# EAGLE design CrawlerProc_ver_02 (EAGLE 6.5.0)
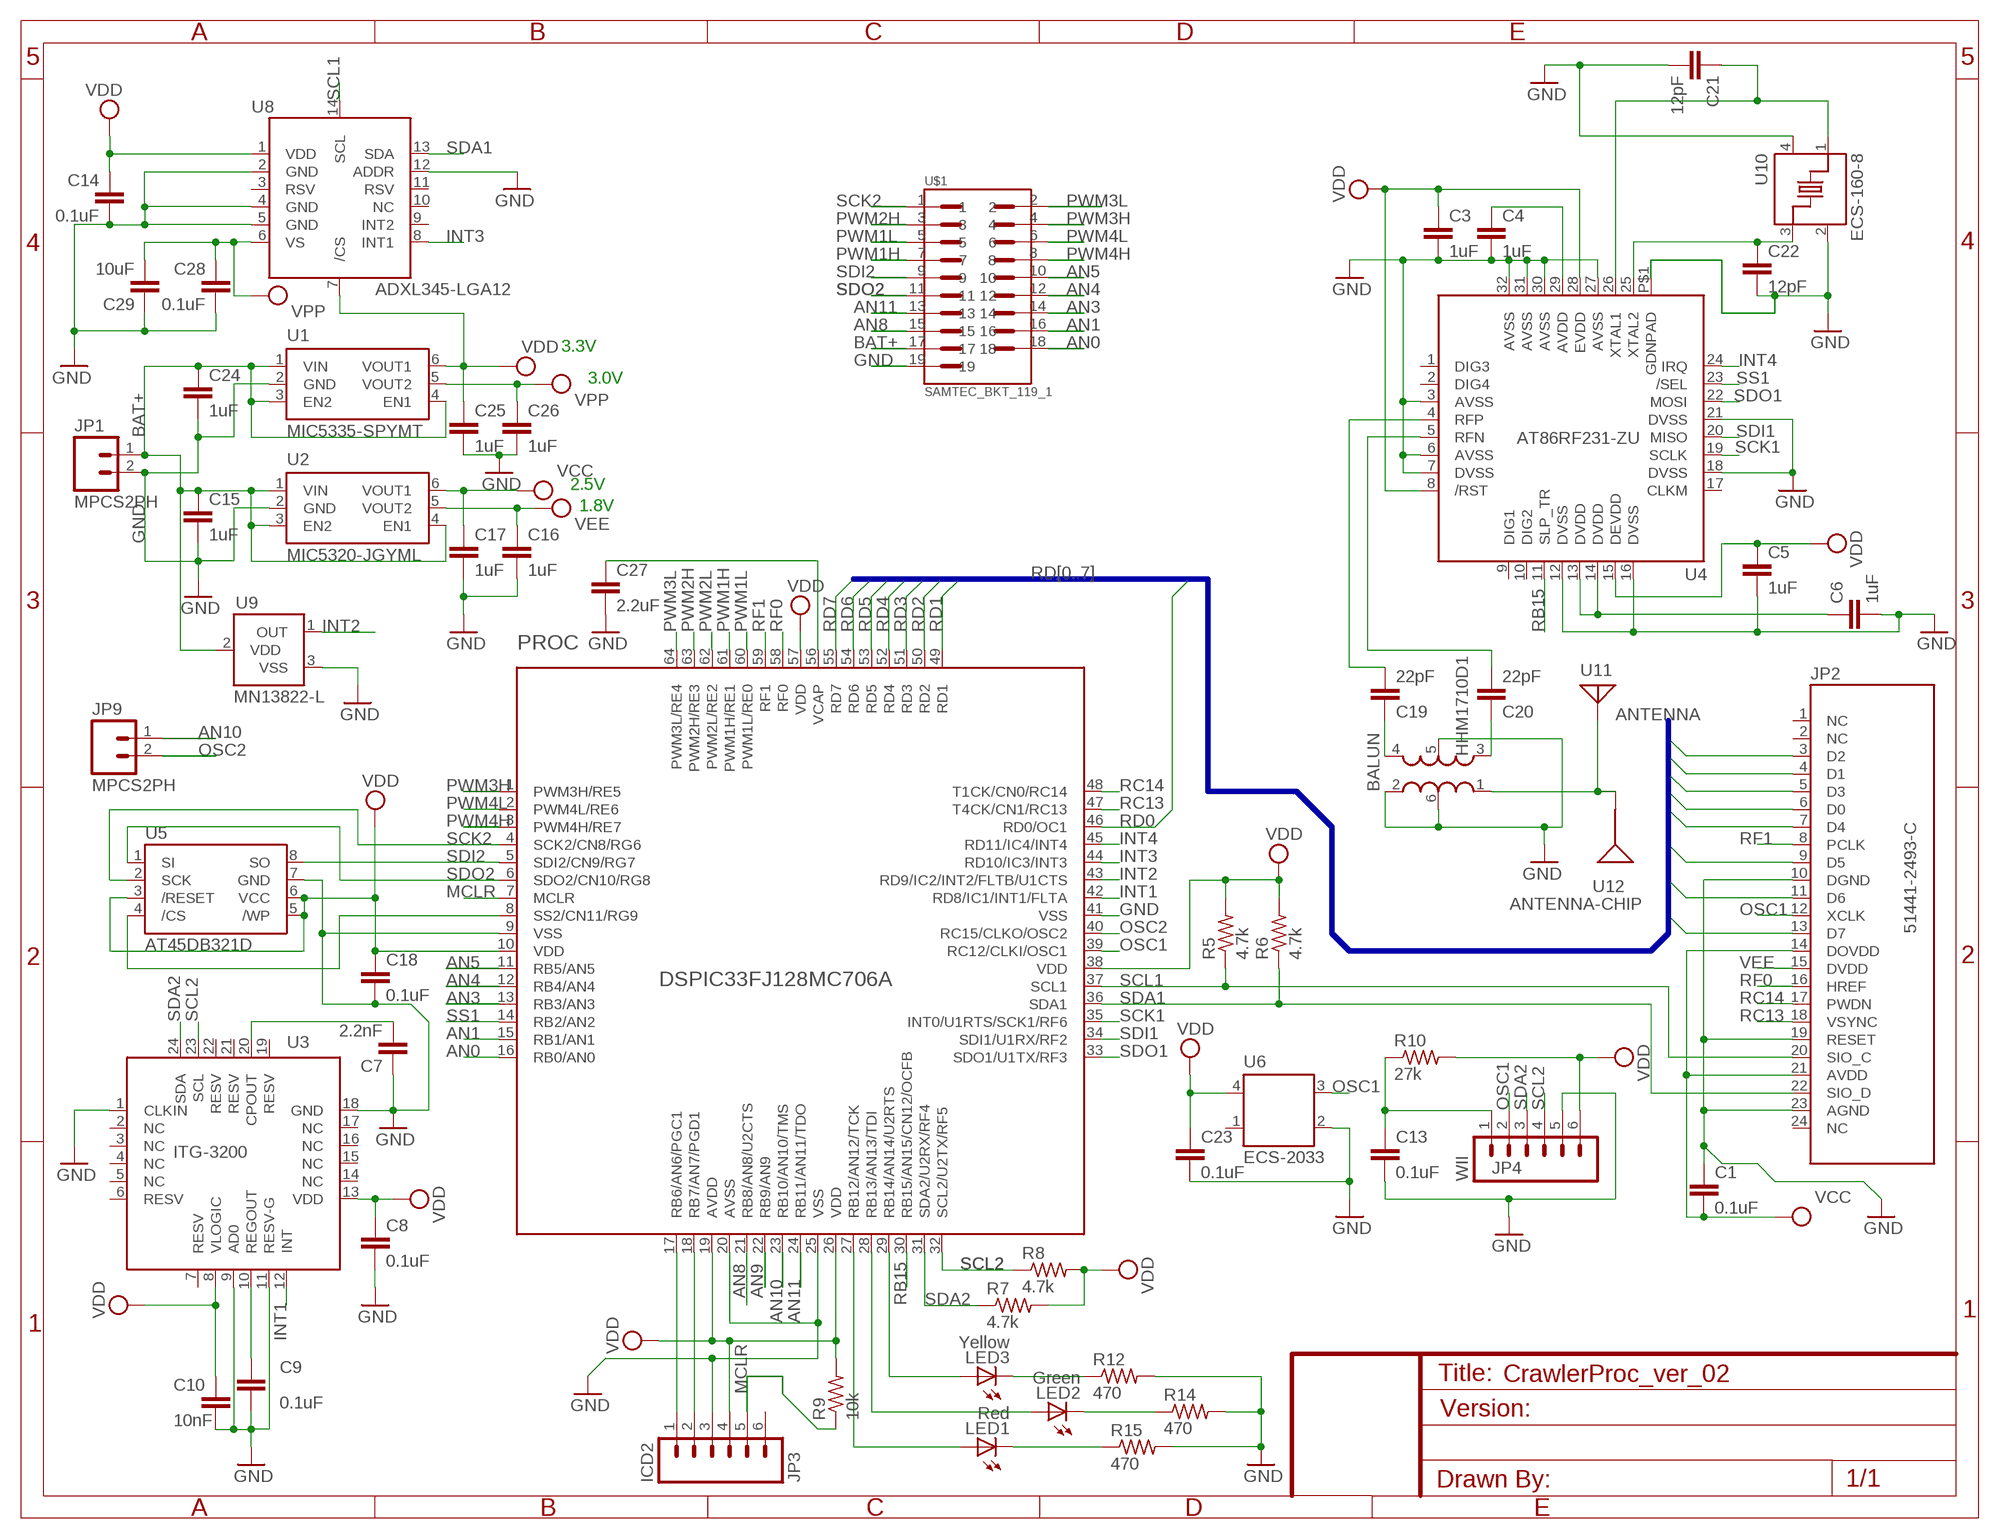
[diagram p0: schematic, sheet 1]

## Parts
BALUN  HHM1710D1  BALUNA  [BALUN]
C1  0.1uF  CAP0402-CAP  [0402-CAP]
C3  1uF  CAP0402-CAP  [0402-CAP]
C4  1uF  CAP0402-CAP  [0402-CAP]
C5  1uF  CAP0402-CAP  [0402-CAP]
C6  1uF  CAP0402-CAP  [0402-CAP]
C7  2.2nF  CAP0402-CAP  [0402-CAP]
C8  0.1uF  CAP0402-CAP  [0402-CAP]
C9  0.1uF  CAP0402-CAP  [0402-CAP]
C10  10nF  CAP0402-CAP  [0402-CAP]
C13  0.1uF  CAP0402-CAP  [0402-CAP]
C14  0.1uF  CAP0402-CAP  [0402-CAP]
C15  1uF  CAP0402-CAP  [0402-CAP]
C16  1uF  CAP0402-CAP  [0402-CAP]
C17  1uF  CAP0402-CAP  [0402-CAP]
C18  0.1uF  CAP0402-CAP  [0402-CAP]
C19  22pF  CAP0402-CAP  [0402-CAP]
C20  22pF  CAP0402-CAP  [0402-CAP]
C21  12pF  CAP0402-CAP  [0402-CAP]
C22  12pF  CAP0402-CAP  [0402-CAP]
C23  0.1uF  CAP0402-CAP  [0402-CAP]
C24  1uF  CAP0402-CAP  [0402-CAP]
C25  1uF  CAP0402-CAP  [0402-CAP]
C26  1uF  CAP0402-CAP  [0402-CAP]
C27  2.2uF  CAP0402-CAP  [0402-CAP]
C28  0.1uF  CAP0402-CAP  [0402-CAP]
C29  10uF  CAP0603-CAP  [0603-CAP]
JP1  MPCS2PH  [MOLEX-PICO_CLASP_S2P]
JP2  51441-2493-C  OV7660FSL_CON-24  [MOLEX-52740-2490]
JP3  ICD2  MPCS6PH  [MOLEX-PICO_CLASP_S6P]
JP4  WII  MPCS6PH  [MOLEX-PICO_CLASP_S6P]
JP9  MPCS2PH  [MOLEX-PICO_CLASP_S2P]
LED1  Red  LEDCHIP-LED0603  [CHIP-LED0603]
LED2  Green  LEDCHIP-LED0603  [CHIP-LED0603]
LED3  Yellow  LEDCHIP-LED0603  [CHIP-LED0603]
PROC  DSPIC33FJ128MC706A  DSPIC33FJ128MC706-I/PT  [TQFP64]
R5  4.7k  R-US_R0402  [R0402]
R6  4.7k  R-US_R0402  [R0402]
R7  4.7k  R-US_R0402  [R0402]
R8  4.7k  R-US_R0402  [R0402]
R9  10k  R-US_R0402  [R0402]
R10  27k  R-US_R0402  [R0402]
R12  470  R-US_R0402  [R0402]
R14  470  R-US_R0402  [R0402]
R15  470  R-US_R0402  [R0402]
U1  MIC5335-SPYMT  MIC5320-JGYML  [MLF-6]
U2  MIC5320-JGYML  [MLF-6]
U3  ITG-3200  ITG-3200-00  [QFN-24]
U4  AT86RF231-ZU  [QFN-32]
U5  AT45DB321D  [MLF(VDFN)-8]
U6  ECS-2033  OSCILLATORS  [OSCILLATOR-SMD]
U8  ADXL345-LGA12  ADXL345  [LGA14]
U9  MN13822-L  VOL_DETECTOR  [SOT-23-3]
U10  ECS-160-8  CRYSTALS  [CRYSTAL-SMD]
U11  ANTENNA  [ANTENNA_PAD]
U12  ANTENNA-CHIP  [ANTENNA-CHIP]
U$1  SAMTEC_BKT_119_1  [SAMTEC_19P_1MM_MICRO_CONN]

## Nets
AN0: PROC.16(RB0/AN0) U$1.18
AN1: PROC.15(RB1/AN1) U$1.16
AN3: PROC.13(RB3/AN3) U$1.14
AN4: PROC.12(RB4/AN4) U$1.12
AN5: PROC.11(RB5/AN5) U$1.10
AN8: PROC.21(RB8/AN8/U2CTS) U$1.15
AN9: PROC.22(RB9/AN9)
AN10: JP9.1 PROC.23(RB10/AN10/TMS)
AN11: PROC.24(RB11/AN11/TDO) U$1.13
BAT+ [sup]: C15.1 C24.1 JP1.1 U1.1(VIN) U1.3(EN2) U1.4(EN1) U2.1(VIN) U2.3(EN2) U2.4(EN1) U9.2(VDD) U$1.17
GND [sup]: BALUN.2(RFGND) BALUN.5(GND) BALUN.6(NC) C1.1 C3.2 C4.2 C5.2 C6.2 C7.1 C8.2 C9.2 C10.2 C13.2 C14.2 C15.2 C16.2 C17.2 C18.2 C21.2 C22.2 C23.2 C24.2 C25.2 C26.2 C27.2 C28.2 C29.1 JP1.2 JP2.10(DGND) JP2.19(RESET) JP2.23(AGND) JP3.3 JP4.5 PROC.9(VSS) PROC.20(AVSS) PROC.25(VSS) PROC.41(VSS) R12.2 R14.2 R15.2 U1.2(GND) U2.2(GND) U3.1(CLKIN) U3.9(AD0) U3.11(RESV-G) U3.18(GND) U4.3(AVSS) U4.6(AVSS) U4.7(DVSS) U4.12(DVSS) U4.16(DVSS) U4.18(DVSS) U4.21(DVSS) U4.27(AVSS) U4.30(AVSS) U4.31(AVSS) U4.32(AVSS) U4.P$1(GDNPAD) U5.7(GND) U6.2(GND) U8.2(GND) U8.4(GND) U8.5(GND) U8.12(ADDR) U9.3(VSS) U10.2(GND) U10.4(GND) U$1.19
INT1: PROC.42(RD8/IC1/INT1/FLTA) U3.12(INT)
INT2: PROC.43(RD9/IC2/INT2/FLTB/U1CTS) U9.1(OUT)
INT3: PROC.44(RD10/IC3/INT3) U8.8(INT1)
INT4: PROC.45(RD11/IC4/INT4) U4.24(IRQ)
MCLR: JP3.5 PROC.7(MCLR) R9.1
N$1: C27.1 PROC.56(VCAP)
N$3: LED3.C R12.1
N$6: LED3.A PROC.29(RB14/AN14/U2RTS)
N$7: LED2.C R14.1
N$8: LED1.C R15.1
N$9: LED2.A PROC.28(RB13/AN13/TDI)
N$11: LED1.A PROC.27(RB12/AN12/TCK)
N$21: JP3.1 PROC.17(RB6/AN6/PGC1)
N$23: C4.1 U4.29(AVDD)
N$24: JP3.2 PROC.18(RB7/AN7/PGD1)
N$28: C6.1 U4.13(DVDD) U4.14(DVDD)
N$29: C7.2 U3.20(CPOUT)
N$32: C9.1 U3.10(REGOUT)
N$43: BALUN.4(BAL4) C19.1
N$46: BALUN.3(BAL3) C20.1
N$47: C19.2 U4.4(RFP)
N$48: PROC.8(SS2/CN11/RG9) U5.4(/CS)
N$49: C20.2 U4.5(RFN)
N$50: C22.1 U4.25(XTAL2) U10.3(IN/OUT)
N$51: C21.1 U4.26(XTAL1) U10.1(IN/OUT)
N$52: BALUN.1(UNBAL) U11.P$1 U12.SIG(SIGNAL)
N$57: C13.1 JP4.1 R10.1
OSC1: JP2.12(XCLK) JP4.2 PROC.39(RC12/CLKI/OSC1) U6.3(OUT)
OSC2: JP9.2 PROC.40(RC15/CLKO/OSC2)
PWM1H: PROC.61(PWM1H/RE1) U$1.7
PWM1L: PROC.60(PWM1L/RE0) U$1.5
PWM2H: PROC.63(PWM2H/RE3) U$1.3
PWM2L: PROC.62(PWM2L/RE2)
PWM3H: PROC.1(PWM3H/RE5) U$1.4
PWM3L: PROC.64(PWM3L/RE4) U$1.2
PWM4H: PROC.3(PWM4H/RE7) U$1.8
PWM4L: PROC.2(PWM4L/RE6) U$1.6
RB15: PROC.30(RB15/AN15/CN12/OCFB) U4.11(SLP_TR)
RC13: JP2.18(VSYNC) PROC.47(T4CK/CN1/RC13)
RC14: JP2.17(PWDN) PROC.48(T1CK/CN0/RC14)
RD0: JP2.6(D0) PROC.46(RD0/OC1)
RD1: JP2.4(D1) PROC.49(RD1)
RD2: JP2.3(D2) PROC.50(RD2)
RD3: JP2.5(D3) PROC.51(RD3)
RD4: JP2.7(D4) PROC.52(RD4)
RD5: JP2.9(D5) PROC.53(RD5)
RD6: JP2.11(D6) PROC.54(RD6)
RD7: JP2.13(D7) PROC.55(RD7)
RF0: JP2.16(HREF) PROC.58(RF0)
RF1: JP2.8(PCLK) PROC.59(RF1)
SCK1: PROC.35(INT0/U1RTS/SCK1/RF6) U4.19(SCLK)
SCK2: PROC.4(SCK2/CN8/RG6) U5.2(SCK) U$1.1
SCL1: JP2.20(SIO_C) PROC.37(SCL1) R5.1 U8.14(SCL)
SCL2: JP4.4 PROC.32(SCL2/U2TX/RF5) R8.1 U3.23(SCL)
SDA1: JP2.22(SIO_D) PROC.36(SDA1) R6.1 U8.13(SDA)
SDA2: JP4.3 PROC.31(SDA2/U2RX/RF4) R7.1 U3.24(SDA)
SDI1: PROC.34(SDI1/U1RX/RF2) U4.20(MISO)
SDI2: PROC.5(SDI2/CN9/RG7) U5.8(SO) U$1.9
SDO1: PROC.33(SDO1/U1TX/RF3) U4.22(MOSI)
SDO2: PROC.6(SDO2/CN10/RG8) U5.1(SI) U$1.11
SS1: PROC.14(RB2/AN2) U4.23(/SEL)
VCC: C1.2 C17.1 JP2.14(DOVDD) JP2.21(AVDD) U2.6(VOUT1)
VDD: C3.1 C5.1 C8.1 C10.1 C14.1 C18.1 C23.1 C25.1 JP3.4 JP4.6 PROC.10(VDD) PROC.19(AVDD) PROC.26(VDD) PROC.38(VDD) PROC.57(VDD) R5.2 R6.2 R7.2 R8.2 R9.2 R10.2 U1.6(VOUT1) U3.8(VLOGIC) U3.13(VDD) U4.8(/RST) U4.15(DEVDD) U4.28(EVDD) U5.3(/RESET) U5.5(/WP) U5.6(VCC) U6.4(VDD) U8.1(VDD) U8.7(/CS)
VEE: C16.1 JP2.15(DVDD) U2.5(VOUT2)
VPP: C26.1 C28.1 C29.2 U1.5(VOUT2) U8.6(VS)
Unconnected: JP2.1(NC) JP2.2(NC) JP2.24(NC) JP3.6 U3.2(NC) U3.3(NC) U3.4(NC) U3.5(NC) U3.6(RESV) U3.7(RESV) U3.14(NC) U3.15(NC) U3.16(NC) U3.17(NC) U3.19(RESV) U3.21(RESV) U3.22(RESV) U4.1(DIG3) U4.2(DIG4) U4.9(DIG1) U4.10(DIG2) U4.17(CLKM) U6.1(NC) U8.3(RSV) U8.9(INT2) U8.10(NC) U8.11(RSV)

## Buses
RD[0..7]

## Notes on the sheet
- 3.3V
- 3.0V
- 2.5V
- 1.8V

## Library data of the parts
BALUN = stan:BALUN
C1 C3-C10 C13-C29 = SparkFun:CAP: Capacitor Standard 0603 ceramic capacitor, and 0.1" leaded capacitor.
JP1 JP9 = stan:MPCS2P: Molex Pico-Clasp Single Row 2 POS
JP2 = stan:OV7660FSL_CON
JP3 JP4 = stan:MPCS6P: Molex Pico-Clasp Single Row 6 Pos
LED1-LED3 = led:LED: LED OSRAM: - CHIPLED LG R971, LG N971, LY N971, LG Q971, LY Q971, LO R971, LY R971 LH N974, LH R974 LS Q976, LO Q976, LY Q976 LO Q996 - Hyper CHIPLED LW Q18S LB Q993, LB Q99A, LB R99A - SideLED LS A670, LO A670, LY A670, LG A670, LP A670 LB A673, LV A673, LT A673, LW A673 LH A674 LY A675 LS A676, LA A676, LO A676, LY A676, LW A676 LS A679, LY A679, LG A679 - Hyper Micro SIDELED® LS Y876, LA Y876, LO Y876, LY Y876 LT Y87S - SmartLED LW L88C, LW L88S LB L89C, LB L89S, LG L890 LS L89K, LO L89K, LY L89K LS L896, LA L896, LO L896, LY L896 - TOPLED LS T670, LO T670, LY T670, LG T670, LP T670 LSG T670, LSP T670, LSY T670, LOP T670, LYG T670 LG T671, LOG T671, LSG T671 LB T673, LV T673, LT T673, LW T673 LH T674 LS T676, LA T676, LO T676, LY T676, LB T676, LH T676, LSB T676, LW T676 LB T67C, LV T67C, LT T67C, LS T67K, LO T67K, LY T67K, LW E67C LS E67B, LA E67B, LO E67B, LY E67B, LB E67C, LV E67C, LT E67C LW T67C LS T679, LY T679, LG T679 LS T770, LO T770, LY T770, LG T770, LP T770 LB T773, LV T773, LT T773, LW T773 LH T774 LS E675, LA E675, LY E675, LS T675 LS T776, LA T776, LO T776, LY T776, LB T776 LHGB T686 LT T68C, LB T68C - Hyper Mini TOPLED® LB M676 - Mini TOPLED Santana® LG M470 LS M47K, LO M47K, LY M47K Source: http://www.osram.convergy.de LUXEON: - LUMILED® LXK2-PW12-R00, LXK2-PW12-S00, LXK2-PW14-U00, LXK2-PW14-V00 LXK2-PM12-R00, LXK2-PM12-S00, LXK2-PM14-U00 LXK2-PE12-Q00, LXK2-PE12-R00, LXK2-PE12-S00, LXK2-PE14-T00, LXK2-PE14-U00 LXK2-PB12-K00, LXK2-PB12-L00, LXK2-PB12-M00, LXK2-PB14-N00, LXK2-PB14-P00, LXK2-PB14-Q00 LXK2-PR12-L00, LXK2-PR12-M00, LXK2-PR14-Q00, LXK2-PR14-R00 LXK2-PD12-Q00, LXK2-PD12-R00, LXK2-PD12-S00 LXK2-PH12-R00, LXK2-PH12-S00 LXK2-PL12-P00, LXK2-PL12-Q00, LXK2-PL12-R00 Source: www.luxeon.com KINGBRIGHT: KA-3528ASYC Source: www.kingbright.com
PROC = stan:DSPIC33FJ128MC706: Microchip dsPIC33FJ128MC706
R5-R10 R12 R14 R15 = rcl:R-US_: RESISTOR, American symbol
U1 U2 = stan:MIC5320: MIC5320 High Performance Dual 150mA Voltage Regulator Package: NOT VERIFIED
U3 = stan:ITG-3200: Invensense 3-axis Gyroscope Package: NOT VERIFIED YET
U4 = stan:AT86RF231: Atmel 2.4GHz transceiver for Zigbee
U5 = stan:AT45DB: Atmel DataFlash AT45DB Series Package: NOT VERIFIED
U6 = stan:OSCILLATOR
U8 = stan:ADXL345
U9 = stan:VOL_DETECTOR
U10 = stan:CRYSTAL
U11 = stan:ANTENNA
U12 = stan:ANTENNA-CHIP
U$1 = AMH:SAMTEC_BKT_119_1

## Net classes
1 sup: width 0.254 mm

## Board
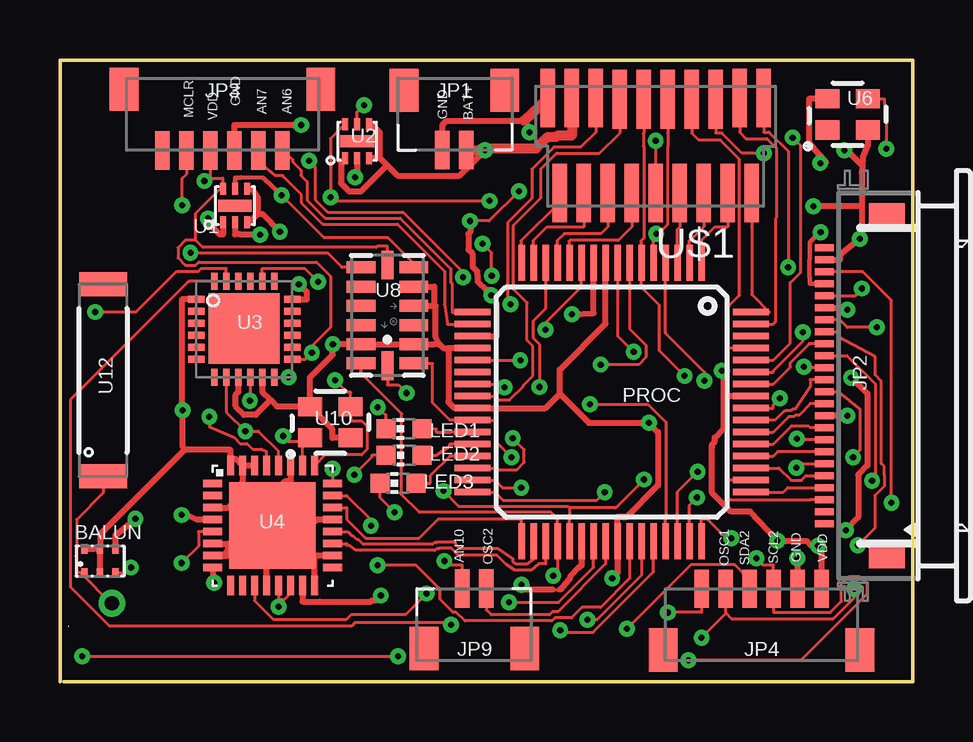
[diagram p1: board, top side]
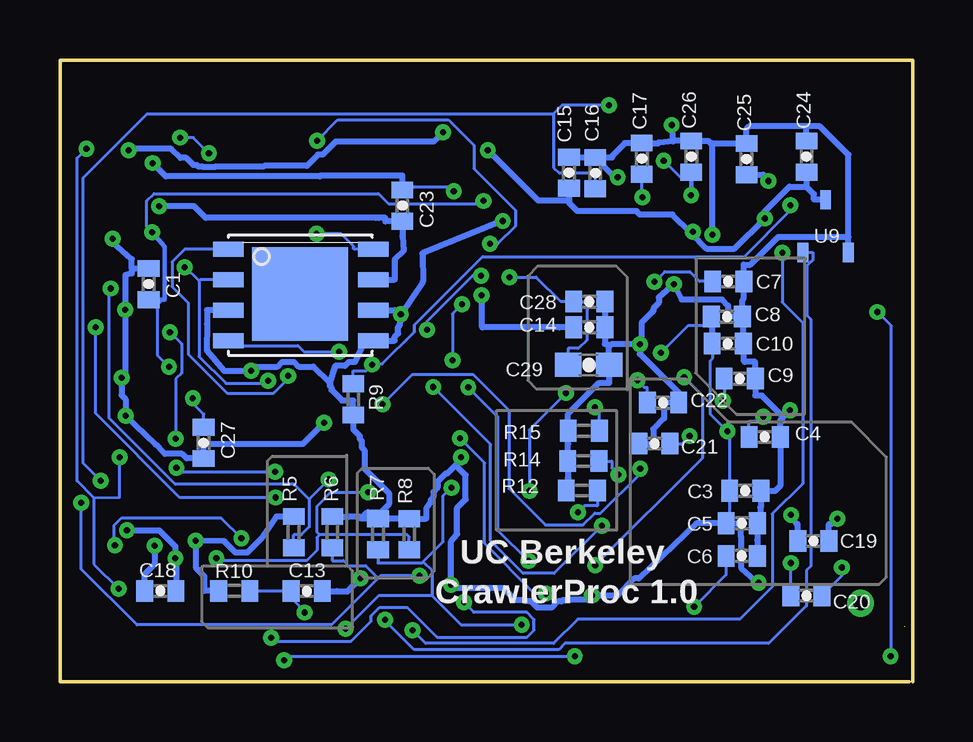
[diagram p2: board, bottom side, seen from below]

Size 35.55 x 25.91 mm. Coordinates in mm from the lower left corner, seen from the top.
Outline: 0.15,0 35.55,0.01 35.55,25.91 0,25.91 0,0.01
Outline: 0.36,2.31 0.35,2.31 0.35,2.3
Copper layers (1*16): Top 0.035mm / dielectric 1.5mm / Bottom 0.035mm
Design rules "default *": minimum track width 5mil, minimum drill 10mil, track to track 5mil, track to pad 5mil, pad to pad 5mil, via to via 5mil, smd to smd 5mil, copper to edge 5mil, drill to drill 5mil, minimum pad ring 10mil, minimum via ring 8mil, stop-mask expansion 4mil, vias tented up to drill 27mil, thermal gap 10mil

### Footprints (pad centres in the part's own frame; a part is rotated, then mirrored left to right if it is on the bottom)
BALUN = smd 0.27 x 0.4: 1 -0.7,-0.5; 2 -0.05,-0.5; 3 0.6,-0.5; 4 0.6,0.5; 5 -0.05,0.5; 6 -0.7,0.5
0402-CAP = smd 0.7 x 0.9: 1 -0.65,0; 2 0.65,0
0603-CAP = smd 1.1 x 1: 1 -0.85,0; 2 0.85,0
MOLEX-PICO_CLASP_S2P = smd 0.6 x 1.6: 1 -0.5,1; 2 0.5,1 | smd 1.2 x 1.8: A -2.1,-1.5; B 2.1,-1.5
MOLEX-52740-2490 = smd 0.3 x 0.8: 1 -5.75,2.5; 2 -5.25,2.5; 3 -4.75,2.5; 4 -4.25,2.5; 5 -3.75,2.5; 6 -3.25,2.5; 7 -2.75,2.5; 8 -2.25,2.5; 9 -1.75,2.5; 10 -1.25,2.5; 11 -0.75,2.5; 12 -0.25,2.5; 13 0.25,2.5; 14 0.75,2.5; 15 1.25,2.5; 16 1.75,2.5; 17 2.25,2.5; 18 2.75,2.5; 19 3.25,2.5; 20 3.75,2.5; 21 4.25,2.5; 22 4.75,2.5; 23 5.25,2.5; 24 5.75,2.5 | smd 0.85 x 1.5: P$1 -7.18,-0.1; P$2 7.18,-0.1
MOLEX-PICO_CLASP_S6P = smd 0.6 x 1.6: 1 -2.5,1; 2 -1.5,1; 3 -0.5,1; 4 0.5,1; 5 1.5,1; 6 2.5,1 | smd 1.2 x 1.8: A -4.1,-1.55; B 4.1,-1.55
CHIP-LED0603 = smd 0.8 x 0.8: A 0,-0.75; C 0,0.75
TQFP64 = smd 1.5 x 0.28: 1 -5.8,3.75; 2 -5.8,3.25; 3 -5.8,2.75; 4 -5.8,2.25; 5 -5.8,1.75; 6 -5.8,1.25; 7 -5.8,0.75; 8 -5.8,0.25; 9 -5.8,-0.25; 10 -5.8,-0.75; 11 -5.8,-1.25; 12 -5.8,-1.75; 13 -5.8,-2.25; 14 -5.8,-2.75; 15 -5.8,-3.25; 16 -5.8,-3.75; 33 5.8,-3.75; 34 5.8,-3.25; 35 5.8,-2.75; 36 5.8,-2.25; 37 5.8,-1.75; 38 5.8,-1.25; 39 5.8,-0.75; 40 5.8,-0.25; 41 5.8,0.25; 42 5.8,0.75; 43 5.8,1.25; 44 5.8,1.75; 45 5.8,2.25; 46 5.8,2.75; 47 5.8,3.25; 48 5.8,3.75 | smd 0.28 x 1.5: 17 -3.75,-5.8; 18 -3.25,-5.8; 19 -2.75,-5.8; 20 -2.25,-5.8; 21 -1.75,-5.8; 22 -1.25,-5.8; 23 -0.75,-5.8; 24 -0.25,-5.8; 25 0.25,-5.8; 26 0.75,-5.8; 27 1.25,-5.8; 28 1.75,-5.8; 29 2.25,-5.8; 30 2.75,-5.8; 31 3.25,-5.8; 32 3.75,-5.8; 49 3.75,5.8; 50 3.25,5.8; 51 2.75,5.8; 52 2.25,5.8; 53 1.75,5.8; 54 1.25,5.8; 55 0.75,5.8; 56 0.25,5.8; 57 -0.25,5.8; 58 -0.75,5.8; 59 -1.25,5.8; 60 -1.75,5.8; 61 -2.25,5.8; 62 -2.75,5.8; 63 -3.25,5.8; 64 -3.75,5.8
R0402 = smd 0.7 x 0.9: 1 -0.65,0; 2 0.65,0
MLF-6 = smd 0.25 x 0.5: 1 -0.5,-0.7; 2 0,-0.7; 3 0.5,-0.7; 4 0.5,0.7; 5 0,0.7; 6 -0.5,0.7 | smd 1.4 x 0.5: P$1 0,0
QFN-24 = smd 0.7 x 0.275: 1 -2,1.25; 2 -2,0.75; 3 -2,0.25; 4 -2,-0.25; 5 -2,-0.75; 6 -2,-1.25; 13 2,-1.25; 14 2,-0.75; 15 2,-0.25; 16 2,0.25; 17 2,0.75; 18 2,1.25 | smd 0.275 x 0.7: 7 -1.25,-2; 8 -0.75,-2; 9 -0.25,-2; 10 0.25,-2; 11 0.75,-2; 12 1.25,-2; 19 1.25,2; 20 0.75,2; 21 0.25,2; 22 -0.25,2; 23 -0.75,2; 24 -1.25,2 | smd 2.95 x 2.95: 25 -0.01,0.03
QFN-32 = smd 0.8 x 0.3: 1 -2.5,1.75; 2 -2.5,1.25; 3 -2.5,0.75; 4 -2.5,0.25; 5 -2.5,-0.25; 6 -2.5,-0.75; 7 -2.5,-1.25; 8 -2.5,-1.75; 17 2.5,-1.75; 18 2.5,-1.25; 19 2.5,-0.75; 20 2.5,-0.25; 21 2.5,0.25; 22 2.5,0.75; 23 2.5,1.25; 24 2.5,1.75 | smd 0.3 x 0.8: 9 -1.75,-2.5; 10 -1.25,-2.5; 11 -0.75,-2.5; 12 -0.25,-2.5; 13 0.25,-2.5; 14 0.75,-2.5; 15 1.25,-2.5; 16 1.75,-2.5; 25 1.75,2.5; 26 1.25,2.5; 27 0.75,2.5; 28 0.25,2.5; 29 -0.25,2.5; 30 -0.75,2.5; 31 -1.25,2.5; 32 -1.75,2.5 | smd 3.6 x 3.6: P$1 0,0.001
MLF(VDFN)-8 = smd 1.27 x 0.635: 1 0,4.31; 2 0,3.04; 3 0,1.77; 4 0,0.5; 5 6.05,0.5; 6 6.05,1.77; 7 6.05,3.04; 8 6.05,4.31 | smd 4 x 3.9: P$1 2.991,2.44
OSCILLATOR-SMD = smd 1 x 0.8: 1 -0.85,-0.65; 2 0.85,-0.65; 3 0.85,0.65; 4 -0.85,0.65
LGA14 = smd 0.5 x 1.2: 1 2,1.1; 2 1.2,1.1; 3 0.4,1.1; 4 -0.4,1.1; 5 -1.2,1.1; 6 -2,1.1; 8 -2,-1.1; 9 -1.2,-1.1; 10 -0.4,-1.1; 11 0.4,-1.1; 12 1.2,-1.1; 13 2,-1.1 | smd 1.2 x 0.5: 7 -2.1,0; 14 2.1,0
SOT-23-3 = smd 0.45 x 0.8: 1 0.2,0.4; 2 1.15,2.6; 3 2.1,0.4
CRYSTAL-SMD = smd 1 x 0.8: 1 -0.85,-0.65; 2 0.85,-0.65; 3 0.85,0.65; 4 -0.85,0.65
ANTENNA_PAD = drill 0.6: P$1 0,0
ANTENNA-CHIP = smd 1 x 2: NC 4,0; SIG -4,0
SAMTEC_19P_1MM_MICRO_CONN = smd 0.61 x 2.44: 1 -4,-2; 2 -3.5,1.955; 3 -3,-2; 4 -2.5,1.955; 5 -2,-1.955; 6 -1.5,1.955; 7 -1,-1.955; 8 -0.5,1.955; 9 0,-1.955; 10 0.5,1.955; 11 1,-1.955; 12 1.5,1.955; 13 2,-1.955; 14 2.5,1.955; 15 3,-2; 16 3.5,1.955; 17 4,-2; 18 4.5,1.955; 19 5,-2

### Placement (x,y rotation side)
BALUN  1.72,5.04 0 top
C1  31.85,16.57 270 bottom
C3  6.98,7.96 0 bottom
C4  6.17,10.2 0 bottom
C5  7.13,6.61 0 bottom
C6  7.13,5.25 0 bottom
C7  7.69,16.68 180 bottom
C8  7.75,15.22 0 bottom
C9  7.21,12.63 0 bottom
C10  7.71,14.09 0 bottom
C13  25.26,3.78 0 bottom
C14  13.48,14.77 0 bottom
C15  14.33,21.21 90 bottom
C16  13.23,21.2 90 bottom
C17  11.29,21.8 90 bottom
C18  31.36,3.79 0 bottom
C19  4.14,5.87 180 bottom
C20  4.43,3.59 180 bottom
C21  10.77,9.93 180 bottom
C22  10.41,11.63 0 bottom
C23  21.28,19.84 270 bottom
C24  4.43,21.89 90 bottom
C25  6.93,21.78 90 bottom
C26  9.23,21.89 90 bottom
C27  29.56,9.96 270 bottom
C28  13.48,15.84 0 bottom
C29  13.51,13.21 180 bottom
JP1  16.44,23.15 180 top
JP2  34.37,12.34 90 top
JP3  6.78,23.15 180 top
JP4  29.24,2.88 0 top
JP9  17.28,2.89 0 top
LED1  14.34,10.54 90 top
LED2  14.35,9.44 90 top
LED3  14.09,8.28 90 top
PROC  23,11.65 270 top
R5  25.81,6.24 90 bottom
R6  24.2,6.24 90 bottom
R7  22.29,6.15 90 bottom
R8  20.99,6.15 90 bottom
R9  23.32,11.77 270 bottom
R10  28.28,3.79 180 bottom
R12  13.8,7.97 180 bottom
R14  13.73,9.2 180 bottom
R15  13.72,10.46 180 bottom
U1  7.29,19.84 0 top
U2  12.38,22.52 0 top
U3  7.68,14.69 0 top
U4  8.86,6.51 0 top
U5  28.53,13.72 0 bottom
U6  32.83,23.64 0 top
U8  13.65,15.27 270 top
U9  4.79,17.49 0 bottom
U10  11.27,10.82 0 top
U11  2.17,3.27 0 top
U12  1.8,12.56 90 top
U$1  25.33,22.32 180 top

### Tracks (layer width: path | path; a pad name or v marks a point on that pad's centre or on a via)
AN0
  Top 0.127: U$1.18 20.83,19.98 19.25,18.39 PROC.16
AN1
  Top 0.127: U$1.16 21.83,18.95 20.3,18.95 19.75,18.39 PROC.15
AN3
  Top 0.127: PROC.13 20.75,18.39 21.03,18.67 22.55,18.67 22.83,18.95 U$1.14
AN4
  Top 0.127: PROC.12 21.25,18.39 23.28,18.39 23.83,18.95 U$1.12
AN5  (via drill 0.25 pad 0.66)
  Top 0.127: v20.25,14.67 20.25,14.97 21.75,16.47 PROC.11 | v18,16.92 18,17.87 v17.62,18.25 | U$1.10 v24.83,22.55
  Bottom 0.127: v18,16.92 18.36,16.92 20.25,15.03 v20.25,14.67 | v24.83,22.55 23.97,23.41 19.36,23.41 18.29,22.35 18.29,21.38 16.57,19.65 16.57,18.99 17.3,18.25 v17.62,18.25
AN8  (via drill 0.25 pad 0.66)
  Top 0.127: v19.19,13.4 18.14,13.4 PROC.21 | v18.79,15.74 18.66,15.87 18.66,19.13 19.68,20.15 19.68,21.37 20.59,22.28 21.71,22.28 22.33,22.91 U$1.15
  Bottom 0.127: v18.79,15.74 19.19,15.34 v19.19,13.4
AN10  (via drill 0.25 pad 0.66)
  Top 0.127: JP9.1 16.78,4.88 16.18,4.88 v16.02,5.04 | PROC.23 18.4,12.4 v18.53,12.27
  Bottom 0.127: v18.53,12.27 17.31,11.05 17.31,6.32 v16.02,5.04
AN11
  Top 0.127: PROC.24 18.14,11.9 18.29,11.75 18.75,11.75 19.32,12.32 19.32,12.35 19.72,12.75 19.72,13.98 19.47,14.22 19.47,15.8 18.91,16.36 18.91,19.03 20.06,20.17 20.06,21.38 20.7,22.03 22.5,22.03 23.33,22.86 U$1.13
BAT+  (via drill 0.25 pad 0.66)
  Top 0.254: 13.63,21.53 13.34,21.82 | U2.1 11.71,21.65 11.71,20.78 12.06,20.44 12.55,20.44 13.63,21.53 | 13.63,21.53 14.07,21.09 16.66,21.09 v17.72,22.15 17.53,22.15 17.53,22.19 | v9.17,18.76 8.44,19.48 8.25,19.48 | 8.25,19.48 7.91,19.14 U1.3 | U1.4 8.04,20.51 8.25,20.18 8.25,19.48 | 6.48,18.82 6.66,18.64 6.79,18.64 U1.1 | 6.48,18.82 | 6.48,18.82 6.17,19.13 v6.17,19.3 | 13.34,21.82 U2.3 | 13.34,21.82 13.34,22.88 12.99,23.22 U2.4
  Top 0.406: JP1.1 17.53,22.15 | 17.53,22.19 17.58,22.23 19.85,22.23 20.33,22.71 20.67,22.71 20.75,22.77 21.33,22.77 U$1.17
  Bottom 0.254: 14.33,20.05 15.61,20.05 v17.72,22.15 | 14.33,20.05 14.33,19.96 13.98,19.61 11.51,19.61 11.37,19.47 10.02,19.47 9.23,18.69 | C15.1 14.33,20.05 | 9.23,18.69 8.59,18.05 7.43,18.05 v6.17,19.3 6.17,19.61 5.14,20.63 4.43,20.63 | 9.23,18.69 v9.17,18.76 | U9.2 4.11,20.09 4.11,20.32 4.43,20.63 | C24.1 4.43,20.63
GND  (via drill 0.25 pad 0.66)
  Top 0.254: 19.34,23.36 16.09,23.36 15.94,23.21 JP1.2 | v19.58,22.89 19.58,23.12 19.34,23.36 | 19.34,23.36 19.34,23.38 | 33.42,19.81 33.41,19.82 v31.41,19.82 | v10.05,23.2 7.28,23.2 JP3.3 | v32.98,12.68 33.66,12.01 33.66,9.02 33.27,8.63 33.27,6.85 v32.76,6.31 | 33.47,21.83 33.43,21.52 32.8,22.15 v32.69,22.15 | U2.2 12.38,21.27 12.26,21.02 v12.3,21.02 | 8.86,6.67 10.61,6.67 10.71,6.76 U4.21 | 8.55,7.53 8.55,6.98 8.86,6.67 | 8.86,6.67 U4.P$1 8.61,6.26 8.61,5.26 | 10.61,5.26 8.61,5.26 | U4.18 10.62,5.26 10.61,5.26 | 10.61,5.26 10.61,4.67 U4.16 | 8.61,5.26 | 8.61,5.26 8.61,4.61 U4.12 | U4.27 9.61,8.36 9.38,8.36 8.55,7.53 | 8.55,7.53 7.61,7.53 | U4.30 U4.31 | 7.11,9.29 7.33,9.29 U4.31 | 8.78,11.74 8.43,12.09 U3.11 | 8.78,11.74 9.05,11.47 U10.4 | 8.78,11.74 8.16,11.13 7.67,11.13 7.32,11.47 7.32,11.98 7.43,12.09 U3.9 | 7.61,7.53 7.29,7.53 7.01,7.26 U4.3 | 7.61,7.53 7.61,8.36 U4.31 | 7.11,9.29 7.11,9.67 5.24,9.67 5.21,9.69 | U4.32 7.11,9.29 | 6.78,5.26 7.01,5.5 7.01,5.76 U4.6 | 6.78,5.26 6.69,5.26 U4.7 | 6.78,5.26 7.01,5.26 8.61,5.26 | 5.21,9.69 5.11,9.79 v5.11,11.31 5.08,11.35 5.08,15.94 U3.1 | 5.21,9.69 1.67,6.14 BALUN.5 | BALUN.5 1.41,5.54 BALUN.6 | 20.84,12 20.84,13.01 22.75,14.92 PROC.9 | 20.84,12 22.05,10.79 v24.55,10.79 24.94,10.4 24.94,8.19 23.61,6.86 23.25,6.86 PROC.41 23.25,4.54 v23.02,4.32 | 20.84,12 20.24,11.4 PROC.25 16.44,11.4 16.19,11.66 16.19,13.9 | U10.4 11.36,10.52 11.36,10.17 U10.2 | U10.4 10.42,12.68 11.37,13.64 v11.37,14.07 11.7,14.07 U8.12 U8.2 15.6,14.07 15.6,14.08 15.8,14.08 | U3.18 10.29,15.94 10.29,16.25 v9.96,16.57 | v8.35,18.63 7.52,18.63 7.51,18.64 7.29,18.64 U1.2 | U6.2 33.68,22.34 33.47,21.83
  Top 0.254: 33.42,19.81 33.42,18.51 33.39,18.49 33.35,18.31 v33.35,18.46 32.52,17.81 32.52,17.59 JP2.23 | U8.5 15.6,16.47 15.6,15.67 | U8.4 15.6,15.67 | PROC.20 16.19,13.9 | 15.8,14.08 15.99,13.9 16.19,13.9 | JP2.19 32.52,15.59 32.52,15.58 32.68,15.57 v32.83,15.5 | v32.82,11.09 32.73,11.09 JP2.10 | v30.74,5.14 JP4.5 | 15.8,14.08 15.66,14.35 15.66,15.67 15.6,15.67 | 33.47,21.83 33.42,21.22 33.42,19.81 | BALUN.2 BALUN.5
  Top 0.406: U$1.19 19.34,23.38
  Bottom 0.254: 22.27,19.33 21.98,19.33 21.98,19.19 C23.2 21.28,18.59 21.22,17.97 21.6,17.6 21.6,16.76 U5.7 | 22.27,19.33 | 22.27,19.33 22.39,19.33 29.47,19.33 29.96,19.82 v31.41,19.82 | v19.58,22.89 19.96,22.51 20.46,22.51 23.71,22.51 23.72,22.51 24.05,22.51 24.59,21.97 24.79,21.97 25.25,21.5 27.04,21.5 27.07,21.47 29.08,21.47 29.1,21.45 29.59,21.45 29.61,21.46 29.78,21.46 29.85,21.53 29.99,21.53 30.28,21.83 30.53,21.83 30.9,22.2 32.59,22.2 v32.69,22.15 | 9.98,22.52 10.59,22.46 10.59,22.45 C17.2 12,22.45 12.53,21.92 12.53,21.85 12.88,21.85 C16.2 | 9.94,22.52 9.94,22.54 C26.2 8.53,22.54 8.42,22.43 8.35,22.43 | 9.94,22.52 | 9.94,22.52 9.98,22.52 | 9.98,22.52 v10.05,23.2 | 2.69,18.54 5.6,18.54 6.76,17.39 7.04,17.39 C7.1 7.04,15.97 7.1,15.92 C8.2 | v32.76,6.31 31.41,6.31 30.74,5.64 v30.74,5.14 30.71,5.12 C18.2 | C15.2 13.62,21.86 13.61,21.85 C16.2 | C21.2 10.81,9.93 10.81,10.53 10.37,10.98 10.37,11.63 C22.2 9.76,12.06 11.37,13.67 v11.37,14.07 | v11.37,14.07 U8.12 12.66,13.96 | 2.69,18.54 2.69,21.96 3.87,23.14 4.43,23.14 | 4.43,23.14 6.83,23.14 6.93,23.04 C25.2 8.35,22.43 | C8.2 7.1,14.84 7.06,14.8 C10.2 7.06,13.39 7,13.34 6.56,13.34 C9.2 6.56,12.28 6.56,11.93 6.29,11.93 5.39,11.03 | 5.39,11.03 5.52,10.9 C4.2 5.52,8.17 5.73,7.96 C3.2 6.33,7.26 U4.3 6.39,6.57 C5.2 6.48,5.9 C6.2 | v5.11,11.31 5.39,11.03 | C24.2 4.43,23.14 | v24.55,10.79 25.42,9.91 29.56,9.91 C27.2 30.26,9.31 30.46,9.5 31.17,9.5 31.2,9.53 | U9.3 2.69,18.54 | v11.37,14.07 11.3,14.14 11.3,14.95 10.84,15.41 10.84,15.45 10.81,15.48 10.81,15.56 10.59,15.79 10.59,16.02 v9.96,16.57 9.64,15.93 7.95,15.93 7.7,15.68 7.7,15.22 C8.2
  Bottom 0.254: v23.02,4.32 23.57,3.77 24.01,3.78 C13.2 | 12.66,13.96 C29.1 12.66,12.45 13.08,12.45 14.37,11.17 R15.2 14.37,9.92 14.38,9.9 R14.2 14.38,8.5 14.36,8.5 14.35,8.09 14.25,8.09 R12.2 | 31.2,9.53 | 31.2,9.53 31.56,9.89 v32.82,11.09 32.82,11.78 32.98,11.95 v32.98,12.68 32.83,12.79 32.83,14.36 | v8.35,18.63 8.35,22.43 | C16.2 12.45,21.07 v12.3,21.02 | 32.56,17.22 32.56,17.62 33.35,18.31 v33.35,18.46 | C28.2 12.83,15.14 12.83,15.13 C14.2 12.83,14.07 12.76,14.07 12.66,13.96 | C1.1 32.56,17.22 | 32.56,17.22 32.56,17.02 32.83,16.94 v32.83,15.5 32.83,14.36 | 32.83,14.36
INT1  (via drill 0.25 pad 0.66)
  Top 0.127: PROC.42 23.75,4.31 22.55,3.11 21.77,3.11 21.33,2.67 20.64,2.67 20.51,2.54 16.88,2.54 16.52,2.9 16.39,2.9 15.84,3.44 15.84,3.86 14.85,4.85 v13.24,4.85 | U3.12 v9.53,12.69
  Bottom 0.127: v9.53,12.69 8.78,11.94 8.78,9.32 v13.24,4.85
INT2  (via drill 0.25 pad 0.66)
  Top 0.127: PROC.43 24.25,4.45 22.39,2.59 v21.99,2.59
  Bottom 0.127: v21.99,2.59 21.99,2.55 20.79,1.35 14.76,1.35 14.5,1.6 6,1.6 4.43,3.17 4.43,4.64 4.25,4.83 4.25,15.1 4.42,15.28 4.42,17.34 4.27,17.49 4.25,17.49 4.17,17.57 4.17,17.89 U9.1
INT3  (via drill 0.25 pad 0.66)
  Top 0.127: U8.8 11.76,17.27 11.18,17.85 5.47,17.85 v5.44,17.88 | v20.85,2.15 20.94,2.06 22.22,2.06 24.75,4.59 PROC.44
  Bottom 0.127: v5.44,17.88 5.44,15.82 4.59,14.97 4.59,8.26 5.85,7 5.85,3.96 7.21,2.61 13.96,2.61 14.97,1.6 20.31,1.6 v20.85,2.15
INT4  (via drill 0.25 pad 0.66)
  Top 0.127: v22.1,11.57 24.51,11.57 25.26,10.82 25.26,6.81 25.25,6.79 PROC.45 | v11.36,8.88 U4.24
  Bottom 0.127: v22.1,11.57 20.86,12.81 18.33,12.81 16.84,11.31 16.84,8.06 15.31,6.54 13.74,6.54 13.25,7.03 13.01,7.03 11.36,8.68 v11.36,8.88
MCLR  (via drill 0.25 pad 0.66)
  Top 0.127: JP3.5 5.28,21.16 5.1,20.97 v5.1,19.85 | PROC.7 23.75,14.71 24.44,14.02 24.44,13.53 24.13,13.22 v22.54,13.22
  Bottom 0.127: 22.52,13.25 22.11,13.25 20.77,14.6 20.77,14.89 17.93,17.72 7.02,17.72 5.1,19.64 v5.1,19.85 | 22.52,13.25 | 22.52,13.25 v22.54,13.22 | 22.52,13.25 22.57,13.19 22.8,12.96 23.32,12.96 R9.1
N$1  (via drill 0.25 pad 0.66)
  Top 0.127: v30.01,11.82 29.74,11.54 29.74,11.4 PROC.56
  Bottom 0.127: C27.1 29.56,11.15 30.01,11.6 v30.01,11.82
N$3  (via drill 0.25 pad 0.66)
  Top 0.127: v13.95,7.06 13.34,7.68 LED3.C
  Bottom 0.127: R12.1 13.15,7.33 13.69,7.33 v13.95,7.06
N$6
  Top 0.127: LED3.A 15.43,8.28 15.43,8.58 16.25,9.4 PROC.29
N$7  (via drill 0.25 pad 0.66)
  Top 0.127: LED2.C 13,9.44 13,9.37 v12.27,8.63
  Bottom 0.127: R14.1 12.54,9.2 12.54,8.91 v12.27,8.63
N$8  (via drill 0.25 pad 0.66)
  Top 0.127: v13.25,11.44 13.56,11.13 13.59,11.13 LED1.C
  Bottom 0.127: R15.1 13.06,11.25 v13.25,11.44
N$9
  Top 0.127: PROC.28 16.25,9.9 16.25,9.82 15.69,9.44 LED2.A
N$11
  Top 0.127: PROC.27 16.25,10.4 15.68,10.4 15.68,10.54 LED1.A
N$21
  Top 0.127: JP3.1 9.7,21.75 9.7,21.66 10.05,21.31 10.05,21.1 10.3,20.84 10.3,20.43 10.31,20.42 10.31,20.06 11.05,19.32 14.19,19.32 16.29,17.22 16.29,16.65 16.35,16.59 16.35,15.39 PROC.17
N$23  (via drill 0.25 pad 0.66)
  Top 0.127: v6.23,11.04 6.23,10.62 7.25,10.19 7.51,9.92 7.79,9.92 8.03,9.69 8.4,9.69 8.61,9.6 U4.29
  Bottom 0.127: C4.1 6.82,10.84 6.63,10.84 v6.23,11.04
N$24
  Top 0.127: JP3.2 8.35,22.07 8.35,21.62 8.96,21.11 9.28,21.11 9.34,21.03 10.06,20.31 10.06,19.96 10.95,19.07 14.08,19.07 16.03,17.12 16.03,15.73 16.15,14.9 PROC.18
N$28  (via drill 0.25 pad 0.66)
  Top 0.127: 9.11,3.42 v9.11,3.13 | 9.11,3.42 9.34,3.42 9.61,3.69 9.61,3.72 U4.14 | U4.13 9.11,3.42
  Bottom 0.127: C6.1 7.78,4.46 v9.11,3.13
N$29  (via drill 0.25 pad 0.66)
  Top 0.127: v10.77,16.67 10.2,17.23 8.43,17.23 U3.20
  Bottom 0.127: v10.77,16.67 10.34,17.1 9.3,17.1 8.88,16.68 C7.2
N$32  (via drill 0.25 pad 0.66)
  Top 0.127: U3.10 7.93,11.73 v7.92,11.71
  Bottom 0.127: C9.1 7.86,11.77 v7.92,11.71
N$43  (via drill 0.25 pad 0.66)
  Top 0.254: v3.15,6.79 2.32,6.12 2.32,5.99 BALUN.4
  Bottom 0.254: C19.1 3.49,6.57 3.41,6.57 v3.15,6.79
N$46  (via drill 0.25 pad 0.66)
  Top 0.127: BALUN.3 2.64,4.54 2.87,4.76 v2.96,4.76
  Bottom 0.127: C20.1 2.96,4.42 v2.96,4.76
N$47  (via drill 0.25 pad 0.66)
  Top 0.254: U4.4 5.71,6.76 5.28,6.95 v5.07,6.95
  Bottom 0.254: C19.2 4.79,6.57 4.84,6.57 v5.07,6.95
N$48  (via drill 0.25 pad 0.66)
  Top 0.127: PROC.8 23.25,14.42 v23.92,13.75
  Bottom 0.127: U5.4 28.28,14.01 25.63,14.01 25.37,13.75 v23.92,13.75
N$49  (via drill 0.25 pad 0.66)
  Top 0.127: U4.5 5.77,6.26 5.77,5.65 v5.08,4.95
  Bottom 0.127: C20.2 v5.08,4.95
N$50  (via drill 0.25 pad 0.66)
  Top 0.127: U4.25 11.06,9.46 12.58,9.46 12.81,9.69 12.81,10.64 12.58,10.88 12.12,10.88 U10.3 12.12,11.5 12.12,12.06 11.98,12.06 v11.48,12.56
  Bottom 0.127: C22.1 11.06,12.27 11.19,12.27 v11.48,12.56
N$51  (via drill 0.25 pad 0.66)
  Top 0.127: 10.11,9.99 9.55,9.99 v9.3,10.24 | U10.1 10.24,9.99 10.11,9.99 | 10.11,9.99 10.11,9.51 U4.26
  Bottom 0.127: C21.1 9.58,9.93 9.58,9.97 v9.3,10.24
N$52
  Top 0.127: 0.85,4.54 2.12,3.27 U11.P$1 | 0.85,4.54 0.69,4.54 0.69,6.76 1.8,7.87 U12.SIG | BALUN.1 0.85,4.54
N$57  (via drill 0.25 pad 0.66)
  Top 0.127: v25.35,2.89 26.74,2.89 JP4.1
  Bottom 0.127: 26.18,3.78 25.35,2.95 v25.35,2.89 | 26.18,3.78 26.45,3.78 27.08,3.78 27.09,3.79 R10.1 | C13.1 26.18,3.78
OSC1  (via drill 0.25 pad 0.66)
  Top 0.127: v34.45,22.21 v34.44,22.21 34.44,23.96 34.37,23.99 34.37,24.29 U6.3 | 27.74,2.89 28,2.64 32.23,2.64 33.11,3.51 v33.11,3.87 | 27.74,2.89 27.74,2.83 v26.75,1.83 | v18.71,3.31 20.78,3.31 22.25,4.77 PROC.39 | v33.06,9.36 33.34,9.66 33.34,11.36 32.46,12.06 32.46,12.09 JP2.12 | JP4.2 27.74,2.89
  Bottom 0.127: 34.13,7.68 34.83,8.37 34.83,21.82 v34.45,22.21 | v26.75,1.83 26.61,1.69 23.42,1.69 22.58,2.53 22.58,2.75 22.22,3.11 21.08,3.11 19.82,1.85 16.09,1.85 15.78,2.16 15.78,2.59 16.09,2.9 18.3,2.9 v18.71,3.31 | 34.13,7.68 34.13,4.9 v33.11,3.87 | 34.13,7.68 33.06,7.69 v33.06,9.36
OSC2
  Top 0.127: JP9.2 17.78,3 17.99,2.79 20.4,2.79 20.53,2.92 20.75,2.92 22.75,4.91 PROC.40
PWM1H
  Top 0.127: PROC.61 27.88,13.9 27.85,13.94 27.85,15.62 28.33,16.1 28.33,21.77 27.53,22.57 26.63,22.57 26.33,22.86 U$1.7
PWM1L  (via drill 0.25 pad 0.66)
  Top 0.127: v30.54,22.68 30.88,22.34 30.88,17.06 30.44,16.63 30.44,14.11 29.74,13.4 PROC.60 | v29.34,22.03 28.43,22.03 27.6,22.86 27.33,22.86 U$1.5
  Bottom 0.127: v29.34,22.03 29.99,22.68 v30.54,22.68
PWM2H
  Top 0.127: U$1.3 28.33,22.91 28.6,22.64 29.47,22.64 29.87,22.24 29.87,19.34 29.83,19.3 29.83,15 29.74,14.9 PROC.63
PWM3H
  Top 0.127: U$1.4 27.83,18.95 27.3,18.95 26.75,18.39 PROC.1
PWM3L
  Top 0.127: PROC.64 29.57,15.4 28.83,16.14 28.83,18.95 U$1.2
PWM4H
  Top 0.127: U$1.8 25.83,18.95 25.75,18.86 PROC.3
PWM4L
  Top 0.127: PROC.2 26.25,18.39 26.28,18.39 26.83,18.95 U$1.6
RB15  (via drill 0.25 pad 0.66)
  Top 0.127: v18.88,10.15 19.35,9.68 19.35,9.15 19.04,8.84 18.2,8.84 18.14,8.9 PROC.30 | U4.11 8.11,3.38 8.89,2.6 11.94,2.6 12.15,2.81 14.42,2.81 v15.29,3.68
  Bottom 0.127: v15.29,3.68 15.76,3.68 17.85,5.77 17.85,9.13 v18.88,10.15
RC13  (via drill 0.25 pad 0.66)
  Top 0.127: PROC.47 26.25,7.37 v26.56,7.68 | v34.06,14.77 32.82,14.77 32.5,15.09 JP2.18
  Bottom 0.127: v26.56,7.68 30.56,7.68 34.06,11.18 v34.06,14.77
RC14  (via drill 0.25 pad 0.66)
  Top 0.127: v33.26,5.69 33.61,6.04 33.98,6.42 33.98,7.78 34.38,8.17 34.38,8.6 34.36,8.62 34.36,8.97 34.24,9.1 34.24,12.53 33.98,12.79 33.98,13.54 32.46,14.36 32.46,14.59 JP2.17 | v27.99,5.98 27.81,5.96 26.97,6.79 26.75,6.79 PROC.48
  Bottom 0.127: v33.26,5.69 33.28,5.71 33.28,6.53 32.98,6.84 28.85,6.84 v27.99,5.98
RD0  (via drill 0.25 pad 0.66)
  Top 0.127: PROC.46 25.75,7.92 v26.58,8.76 | v30.7,8.92 30.87,9.09 JP2.6
  Bottom 0.127: v30.7,8.92 30.54,8.76 v26.58,8.76
RD1
  Top 0.127: PROC.49 30.16,7.9 30.34,8.09 JP2.4
RD2
  Top 0.127: JP2.3 31.28,7.59 31.26,7.57 27.99,7.57 27.86,7.64 27.86,8.4 PROC.50
RD3
  Top 0.127: PROC.51 29.97,8.9 30.48,8.4 30.91,8.4 31.1,8.59 JP2.5
RD4
  Top 0.127: PROC.52 29.74,9.4 29.92,9.59 31.28,9.59 JP2.7
RD5
  Top 0.127: PROC.53 29.74,9.9 30.48,10.65 31.22,10.65 31.28,10.59 JP2.9
RD6
  Top 0.127: JP2.11 31.28,11.59 30.82,11.11 30.66,11.11 30.59,11.05 30.38,11.05 29.74,10.4 PROC.54
RD7
  Top 0.127: PROC.55 29.8,10.9 30.18,11.28 30.23,11.28 30.25,11.3 30.49,11.3 30.55,11.37 30.65,11.37 31.28,12.3 31.28,12.59 JP2.13
RF0
  Top 0.127: PROC.58 29.74,12.4 30.45,13.12 30.45,13.31 31.23,14.09 31.28,14.09 JP2.16
RF1  (via drill 0.25 pad 0.66)
  Top 0.127: v30.96,14.57 30.96,14.18 29.74,12.95 29.74,12.9 PROC.59 | JP2.8 30.76,10.09 v30.72,10.13
  Bottom 0.127: v30.96,14.57 30.48,14.08 30.48,12.87 30.72,12.62 v30.72,10.13
SCK1
  Top 0.127: 12.34,5.48 12.53,5.48 12.54,5.48 15.63,5.48 15.69,5.54 15.79,5.54 15.81,5.56 16.32,5.56 16.59,5.28 18.21,5.27 18.61,4.88 18.97,4.65 19.64,4.65 19.96,4.91 20.25,4.91 PROC.35 | 12.34,5.48 | 12.34,5.48 12.1,5.66 11.95,5.68 11.95,5.76 U4.19
SCK2  (via drill 0.25 pad 0.66)
  Top 0.127: v26.87,12.55 26.87,12.91 25.25,14.53 PROC.4 | v30.36,17.28 30.36,22.11 29.56,22.91 29.33,22.91 U$1.1
  Bottom 0.127: 29.75,16.7 29.75,13.55 28.63,12.43 26.99,12.43 v26.87,12.55 | U5.2 29.7,16.76 29.75,16.7 | 29.75,16.7 30.32,17.28 v30.36,17.28
SCL1  (via drill 0.25 pad 0.66)
  Top 0.127: JP2.20 33.15,16.09 33.38,16.39 v33.43,16.39 | 21.25,7.25 21.25,6.79 PROC.37 | v24.35,8.43 23.17,7.25 21.25,7.25 | v15.98,7.95 16.62,7.32 21.18,7.32 21.25,7.25 | U8.14 13.65,12.38 14.11,12.38 v14.45,12.03
  Bottom 0.127: 25.17,7.61 25.79,8.23 30.74,8.23 33.5,10.99 33.5,16.31 v33.43,16.39 | 25.17,7.61 25.17,7.6 25.17,6.46 25.49,6.13 25.81,6.13 R5.1 | 25.17,7.61 v24.35,8.43 | v14.45,12.03 15.98,10.5 v15.98,7.95
SCL2  (via drill 0.25 pad 0.66)
  Top 0.127: v0.92,1.06 v14.09,1.06 | v1.47,15.41 3.17,15.41 4.87,17.1 5.76,17.1 5.89,17.23 6.93,17.23 U3.23 | v26.2,0.9 30.88,0.9 33.63,3.65 33.63,4.1 33.33,4.4 32.89,4.4 32.58,4.09 32.58,3.35 32.12,2.89 29.74,2.89 JP4.4 29.74,4.87 29.3,4.87 v29.03,5.14 | v22.71,7.89 22.39,7.57 18.47,7.57 18.14,7.9 PROC.32
  Bottom 0.127: v26.2,0.9 26.04,1.06 v14.09,1.06 | v1.47,15.41 0.92,14.86 v0.92,1.06 | 24.73,6.13 24.84,6.24 24.84,7.32 24.26,7.89 v22.71,7.89 | 24.73,6.13 24.84,6.02 24.84,5.48 25.27,5.05 28.93,5.05 v29.03,5.14 | 24.73,6.13 21.08,6.13 20.99,6.04 R8.1
SDA1  (via drill 0.25 pad 0.66)
  Top 0.127: U8.13 12.55,12.87 14.24,11.18 14.24,7.8 14.98,7.06 20.48,7.06 20.75,6.79 PROC.36 20.75,5.38 20.75,4.91 20.75,4.61 v20.56,4.43 | v34.66,7.47 34.66,15.89 33.47,17.09 JP2.22
  Bottom 0.127: 22.28,4.32 24.23,2.37 32.34,2.37 34.66,4.69 v34.66,7.47 | v20.56,4.43 22.18,4.43 22.28,4.32 | 22.28,4.32 22.81,4.84 23.55,4.84 23.73,5.05 24.2,5.05 R6.1
SDA2  (via drill 0.25 pad 0.66)
  Top 0.127: U3.24 5.37,16.69 0.44,11.75 0.44,3.95 2.04,2.35 12.17,2.35 12.3,2.48 16.2,2.48 v16.3,2.37 | JP4.3 28.74,4.26 28.13,4.88 26.3,4.88 v23.64,2.22 | v19.23,8.09 18.45,8.09 18.14,8.4 PROC.31
  Bottom 0.127: 20.04,3.59 18.82,2.37 v16.3,2.37 | 20.04,3.59 22.26,3.59 v23.64,2.22 | 20.41,5.01 20.04,4.64 20.04,3.59 | 20.41,5.01 19.57,5.84 19.57,7.75 v19.23,8.09 | 20.41,5.01 20.46,4.96 22.29,4.96 R7.1
SDI1
  Top 0.127: PROC.34 19.76,5.13 19.45,4.91 19.04,4.91 18.89,5 18.89,5.13 18.27,5.55 16.68,5.55 16.42,5.81 15.7,5.81 15.69,5.79 15.58,5.79 15.52,5.73 12.64,5.73 12.44,5.93 12.38,5.93 12.24,6.07 12.18,6.07 12.04,6.21 11.95,6.26 U4.20
SDI2  (via drill 0.25 pad 0.66)
  Top 0.127: U$1.9 25.33,22.86 25.36,22.84 25.36,22.33 25.33,22.31 25.33,19.06 24.94,18.67 v24.86,18.67 24.86,18.51 24.75,18.39 PROC.5
  Bottom 0.127: U5.8 23.31,18.03 23.31,18.14 23.84,18.67 v24.86,18.67
SDO1
  Top 0.127: U4.22 11.95,7.26 11.95,6.78 12.74,5.99 14.97,5.99 15.78,6.79 19.25,6.79 PROC.33
SDO2  (via drill 0.25 pad 0.66)
  Top 0.127: U$1.11 24.33,22.86 24.31,22.84 24.31,22.33 24.33,22.31 24.33,18.48 24.25,18.39 PROC.6 24.25,16.43 24.99,15.69 24.99,13.79 v26.04,12.75
  Bottom 0.127: U5.1 30.35,18.03 30.88,17.5 30.88,16.47 30.2,15.79 30.2,13.65 28.59,12.03 26.65,12.03 26.04,12.64 v26.04,12.75
SS1  (via drill 0.25 pad 0.66)
  Top 0.127: PROC.14 20.25,15.55 19.73,15.03 19.73,14.33 19.99,14.07 v19.99,12.29 | U4.23 11.95,7.76 12.96,6.75 v12.96,6.51
  Bottom 0.127: v12.96,6.51 14.95,4.52 16.24,4.52 17.6,5.87 17.6,9.89 v19.99,12.29
VCC  (via drill 0.25 pad 0.66)
  Top 0.127: v17.9,20.04 11.43,20.04 v11.27,20.2 11.27,22.64 11.86,23.22 U2.6 | v31.01,13.13 31.24,13.13 31.28,13.09 JP2.14
  Top 0.178: JP2.21 31.26,16.59 31.26,16.85 31.23,16.87 31.25,18.33 31.61,18.68 v31.71,18.74
  Bottom 0.127: v31.71,18.74 31.93,18.96 31.93,20.04 31.63,20.34 22.28,20.34 21.86,19.92 18.02,19.92 v17.9,20.04 | v11.27,20.2 11.29,20.22 C17.1 | 31.27,15.92 31.49,15.7 31.49,13.61 v31.01,13.13
  Bottom 0.178: C1.2 31.27,15.92 31.19,15.92 31.19,16.24 31.18,16.25 31.18,18.12 v31.71,18.74
VDD  (via drill 0.25 pad 0.66)
  Top 0.127: U8.1 15.54,13.27 15.54,11.62 16.25,10.9 PROC.26 17.67,10.9 18.14,10.9 18.14,10.05 v18.83,9.36 | 5.65,18.4 5.22,18.4 4.92,18.09 4.92,17.66 5.22,17.36 5.65,17.36 5.78,17.48 10.69,17.48 11.29,16.89 11.29,14.78 10.5,13.99 v10.5,13.71 10.36,13.58 | 5.65,18.4 5.95,18.1 13.18,18.1 13.24,18.16 13.65,18.16 U8.7 | 5.65,18.4 5.65,19.52 6.67,20.54 U1.6 6.79,20.98 6.28,20.98 | 6.28,20.98 6.14,20.98 v6.02,20.87 | 10.36,13.58 10.22,13.44 U3.13 | 10.36,13.58 | 10.36,13.58 | U3.8 6.93,11.24 v7.73,10.45 8.27,10.45 9.11,9.6 U4.28 | 6.28,20.98 JP3.4 | v19.14,20.45 17.89,19.2 v17.09,19.2 | 20.54,3.84 20.84,3.84
  Top 0.254: 11.86,3.33 10.85,3.33 10.84,3.34 10.13,3.34 10.11,3.36 U4.15 | 11.86,3.33 | 11.86,3.33 12.95,3.33 13.01,3.39 13.17,3.39 v13.38,3.6 | v17.09,19.2 17.1,19.18 17.11,18.75 17.03,18.67 17.03,18.01 17.2,17.85 17.2,17.3 17.39,17.11 17.39,16.95 17.42,16.93 17.42,16.68 17.76,16.33 17.85,16.33 v17.98,16.11 18.2,15.74 18.21,14.41 18.2,14.4 | 20.84,3.84 20.86,3.84 21.26,4.32 21.26,4.39 21.64,4.76 21.71,4.85 21.75,4.85 PROC.38 | 27.67,11.9 27.67,12.87 v27.59,12.96 | 27.67,11.9 27.67,10.56 27.29,10.18 27.29,9.99 27.18,9.88 27.18,9.76 27.18,7.87 27.74,7.31 27.97,7.1 28.76,7.1 v29.9,5.87 31.13,5.87 31.33,5.67 v31.6,5.67 31.74,5.53 JP4.6 | 27.67,11.9 27.79,11.9 PROC.57 | 20.54,3.84 19.45,3.84 v19.24,4.04 | 31.92,21.65 31.23,22.46 31.22,23.78 31.23,23.78 31.23,24.29 U6.4 | 31.92,21.65 | 31.92,21.65 31.92,21.62 v31.69,21.62 | PROC.19 18.2,14.4 | 18.2,14.4 | U4.8 6.38,4.25 v6.42,4.13 | v21.34,15.32 22.25,15.37 PROC.10
  Bottom 0.127: 18.99,9.06 18.99,9.2 v18.83,9.36 | 8.4,14.84 9.38,14.84 v10.5,13.71 | C10.1 8.36,13.45 8.44,13.37 8.44,11.16 v7.73,10.45 7.63,10.35 7.63,8.6 C3.1 7.63,6.73 7.51,6.61 | 18.99,9.05 18.99,9.06 | 18.99,9.06 19.02,9.06 | 19.02,9.06 | 21.28,20.63 19.32,20.63 v19.14,20.45
  Bottom 0.254: 24.31,12.45 24.99,13.13 25.6,13.13 25.8,13.33 26.28,13.33 26.48,13.13 27.41,13.13 v27.59,12.96 28.7,12.96 29.43,13.81 29.42,14.91 29.42,14.92 29.42,15.49 U5.3 | v6.02,20.87 6.02,20.84 6.23,21.13 C25.1 | C8.1 8.4,14.84 8.36,14.8 C10.1 | v31.69,21.62 31.14,21.06 24.72,21.06 24.69,21.09 21.28,21.09 21.28,20.63 C23.1 | 16.55,3.4 16.19,3.4 16.16,3.37 15.92,3.37 15.65,3.1 15.04,3.1 14.78,3.36 14.66,3.36 14.62,3.4 14.5,3.4 14.48,3.41 13.56,3.41 v13.38,3.6 12.31,3.6 11.59,4.31 11.42,4.31 9.02,6.61 | 16.55,3.4 | 16.55,3.4 17.06,3.9 19.01,3.9 v19.24,4.04 19.25,5.85 18.99,6.15 18.99,7.26 18.64,7.6 18.64,8.62 18.99,8.96 18.99,9.05 | 19.02,9.06 19.41,8.68 19.47,8.68 19.81,8.33 19.81,8.08 19.99,7.91 19.99,7.72 20.08,7.58 20.08,7.53 20.29,7.23 20.29,6.8 R8.2 R7.2 23,6.8 | 17.93,14.77 14.74,14.78 14.74,14.77 C14.1 | 17.93,14.77 | 17.93,14.77 17.95,14.77 17.96,16.1 v17.98,16.11 | v21.34,15.32 21.38,14.86 21.45,14.79 21.45,14.52 21.6,14.37 21.6,14.22 U5.5 22.75,14.4 23.25,13.32 23.52,13.32 23.67,13.16 24.07,13.16 24.31,12.45 | 24.31,12.45 24.29,12.44 24.29,12.33 24.23,12.26 24.23,12.16 23.8,11.72 23.32,11.72 R9.2 23.32,10.52 23.06,10.25 23.06,10.13 22.97,10.04 22.97,9.77 22.86,9.66 22.86,8.88 | 22.86,8.88 | 22.86,8.88 21.84,7.87 21.84,7.39 22.18,7.05 22.66,7.05 22.67,7.06 22.74,7.06 23,6.8 | 23,6.8 23.08,6.89 23.49,6.89 R6.2 | 9.02,6.61 C5.1 7.51,6.61 7.17,6.61 7.17,6.08 7.14,6.06 7.14,4.73 6.53,4.19 v6.42,4.13 | 9.02,6.61 | v17.09,19.2 20.44,17.85 20.42,16.68 v21.34,15.32 | R10.2 29.54,3.79 29.54,4.4 29.89,4.75 v29.9,5.87 28.68,5.85 28.68,5.84 28.23,5.39 27.74,5.39 27.16,5.97 26.53,6.89 R5.2
  Bottom 0.254: C18.1 32.01,4.49 31.6,4.9 v31.6,5.67 | U5.6 21.6,15.49 21.51,15.4 21.45,15.4 v21.34,15.32
VEE  (via drill 0.25 pad 0.66)
  Top 0.127: U2.5 12.38,23.74 v12.67,24.02 | JP2.15 32.81,13.59 33.98,12.41 33.98,8.52 v33.86,8.39
  Bottom 0.127: 14.97,23.67 14.97,21.43 14.76,21.21 13.36,21.21 13.23,21.09 C16.1 | v12.67,24.02 14.62,24.02 14.97,23.67 | v33.86,8.39 34.58,9.11 34.58,21.01 31.92,23.67 14.97,23.67
VPP  (via drill 0.25 pad 0.66)
  Top 0.127: U8.6 14.75,17.42 13.68,18.5 11.01,18.5 v9.24,20.27 | v10.38,21.72 10.64,21.45 10.64,20.09 11.16,19.57 14.3,19.57 16.81,17.06 v16.81,16.86
  Top 0.178: U1.5 7.29,21.01 7.55,21.01 7.55,21.02 8.47,21.01 v9.24,20.27
  Bottom 0.127: 9.23,20.95 9.62,20.95 v10.38,21.72 | v16.81,16.86 15.7,16.86 14.67,15.84 C28.1 13.59,15.84 13.59,14.24 13.94,13.9 14.36,13.9 C29.2
  Bottom 0.178: C26.1 9.23,20.95 9.23,20.67 9.24,20.67 v9.24,20.27

### Text on the board
tPlace: GND | MCLR | VDD | AN7 | AN6 | GND | BAT+ | AN10 | OSC2 | OSC1 | SDA2 | SCL2 | GND | VDD
bPlace: UC Berkeley | CrawlerProc 1.0
tNames: U2 | U1
bDocu: GYRO | XL | RADIO | LED | I2C2 | I2C1 | WII